# EAGLE schematic AtxPowerDispatcher3 (EAGLE 7.2.0)
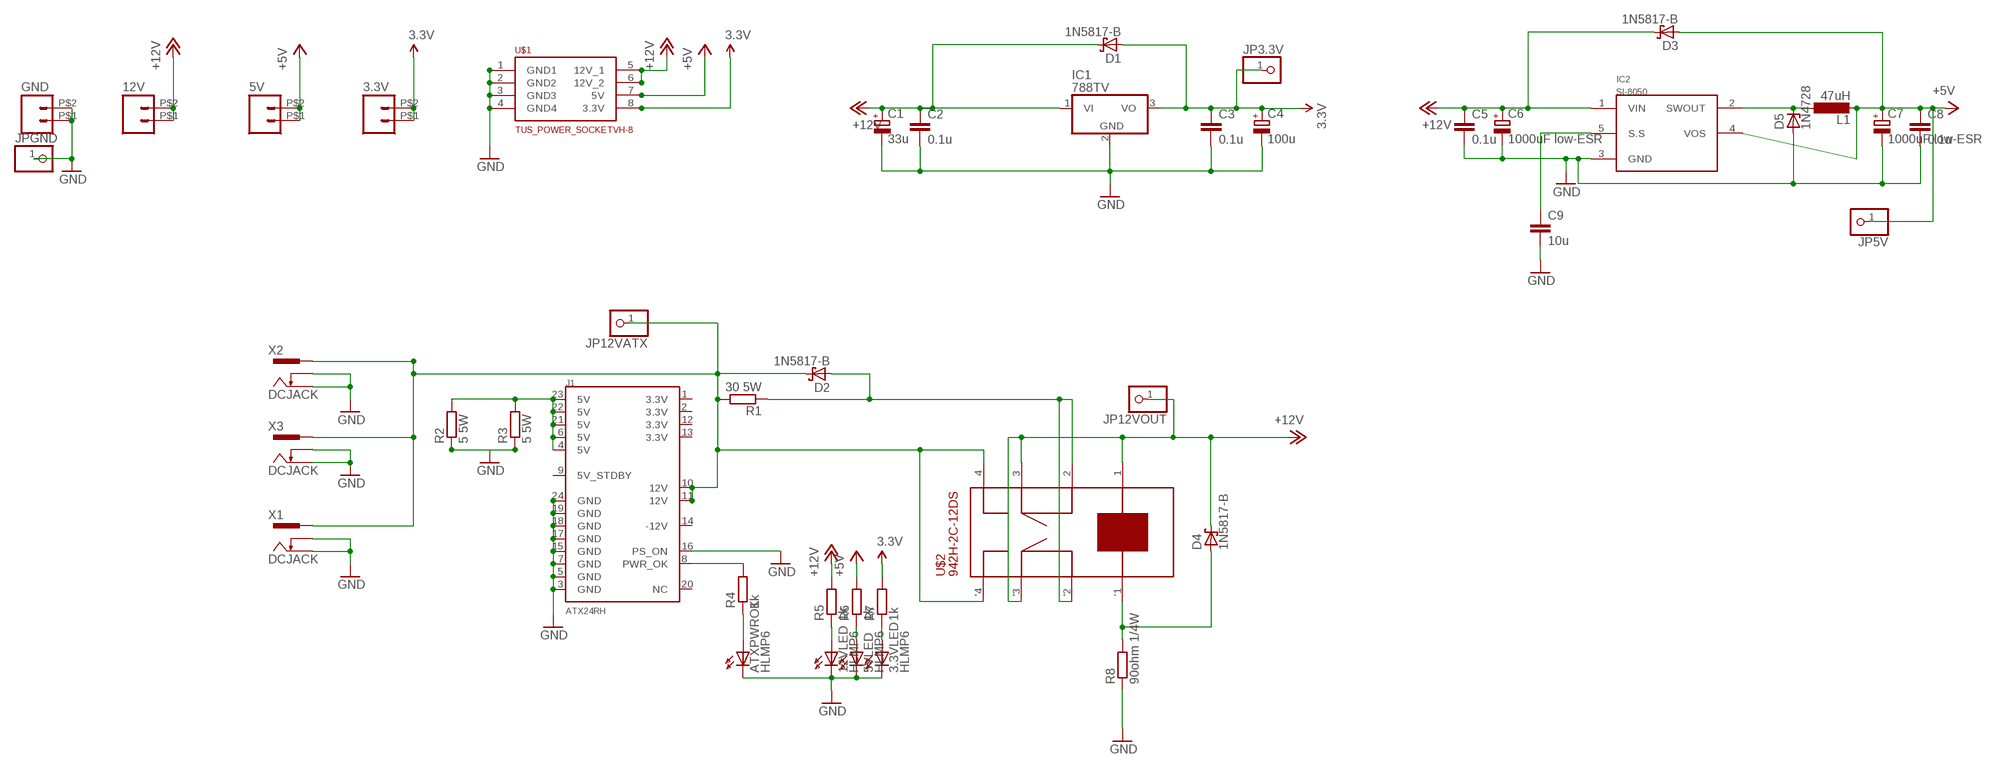
[diagram p0: schematic, sheet 1]

## Parts
3.3V  M02PTH2  [1X02_BIG]
3.3VLED  HLMP6  [HLMP6]
5V  M02PTH2  [1X02_BIG]
5VLED  HLMP6  [HLMP6]
12V  M02PTH2  [1X02_BIG]
12VLED  HLMP6  [HLMP6]
ATXPWROK  HLMP6  [HLMP6]
C1  33u  CPOL-EUE2,5-6E  [E2,5-6E]
C2  0.1u  C-EUC0603  [C0603]
C3  0.1u  C-EUC0603  [C0603]
C4  100u  CPOL-EUE2,5-6E  [E2,5-6E]
C5  0.1u  C-EUC0603  [C0603]
C6  1000uF low-ESR  CPOL-EUE5-10.5  [E5-10,5]
C7  1000uF low-ESR  CPOL-EUE5-10.5  [E5-10,5]
C8  0.1u  C-EUC0603  [C0603]
C9  10u  C-EUC1206  [C1206]
D1  1N5817-B  [DO41-7.6]
D2  1N5817-B  [DO41-7.6]
D3  1N5817-B  [DO41-7.6]
D4  1N5817-B  [DO41-7.6]
D5  1N4728  [DO41Z10]
GND  M02PTH2  [1X02_BIG]
IC1  788TV  [TO220V]
IC2  SI-8050  [TO220-5]
J1  ATX24RH  [ATX24_RIGHT_ANGLE]
JP3.3V  PINHD-1X1  [1X01]
JP5V  PINHD-1X1  [1X01]
JP12VATX  PINHD-1X1  [1X01]
JP12VOUT  PINHD-1X1  [1X01]
JPGND  PINHD-1X1  [1X01]
L1  47uH  L-EU2200-12.7  [2200-12.7]
R1  30 5W  R-EU_0922/22  [0922/22]
R2  5 5W  R-EU_0922/22  [0922/22]
R3  5 5W  R-EU_0922/22  [0922/22]
R4  1k  R-EU_R0603  [R0603]
R5  1k  R-EU_R0603  [R0603]
R6  1k  R-EU_R0603  [R0603]
R7  1k  R-EU_R0603  [R0603]
R8  90ohm 1/4W  R-EU_0207/10  [0207/10]
U$1  TUS_POWER_SOCKETVH-8  [VH_8]
U$2  942H-2C-12DS  [942H]
X1  DCJACK  [2DC-0005D100]
X2  DCJACK  [2DC-0005D100]
X3  DCJACK  [2DC-0005D100]

## Nets
3.3V: 3.3V.P$1 3.3V.P$2 C3.1 C4.+ D1.A IC1.3(VO) JP3.3V.1 R7.2 U$1.8(3.3V)
+5V: 5V.P$1 5V.P$2 C7.+ C8.1 D3.A IC2.4(VOS) JP5V.1 L1.2 R6.2 U$1.7(5V)
+12V: 12V.P$1 12V.P$2 C1.+ C2.1 C5.1 C6.+ D1.C D3.C D4.C IC1.1(VI) IC2.1(VIN) JP12VOUT.1 R5.2 U$1.5(12V_1) U$1.6(12V_2) U$2.1 U$2.3 U$2.'3('2)
GND: 3.3VLED.K 5VLED.K 12VLED.K ATXPWROK.K C1.- C2.2 C3.2 C4.- C5.2 C6.- C7.- C8.2 C9.2 D5.A GND.P$1 GND.P$2 IC1.2(GND) IC2.3(GND) J1.3(GND) J1.5(GND) J1.7(GND) J1.15(GND) J1.16(PS_ON) J1.17(GND) J1.18(GND) J1.19(GND) J1.24(GND) JPGND.1 R2.1 R3.1 R8.1 U$1.1(GND1) U$1.2(GND2) U$1.3(GND3) U$1.4(GND4) X1.2 X1.3 X2.2 X2.3 X3.2 X3.3
N$1: 12VLED.A R5.1
N$2: J1.8(PWR_OK) R4.2
N$3: J1.4(5V) J1.6(5V) J1.21(5V) J1.22(5V) J1.23(5V) R2.2 R3.2
N$4: 5VLED.A R6.1
N$5: 3.3VLED.A R7.1
N$6: ATXPWROK.A R4.1
N$8: D4.A R8.2 U$2.'1('4)
N$9: D5.C IC2.2(SWOUT) L1.1
N$10: D2.A R1.1 U$2.2 U$2.'2('3)
N$11: D2.C J1.10(12V) J1.11(12V) JP12VATX.1 R1.2 U$2.4 U$2.'4('1) X1.1 X2.1 X3.1
N$17: C9.1 IC2.5(S.S)
Unconnected: J1.1(3.3V) J1.2(3.3V) J1.9(5V_STDBY) J1.12(3.3V) J1.13(3.3V) J1.14(-12V) J1.20(NC)

## Library data of the parts
3.3V 5V 12V GND = myparts:M02: Header 2 Standard 2-pin 0.1" header. Use with straight break away headers (SKU : PRT-00116), right angle break away headers (PRT-00553), swiss pins (PRT-00743), machine pins (PRT-00117), and female headers (PRT-00115). Molex polarized connector foot print use with SKU : PRT-08233 with associated crimp pins and housings.
3.3VLED 5VLED 12VLED ATXPWROK = display-hp:HLMP6: LED 2mm horizontal; MF: AGILENT TECHNOLOGIES; MPN: HLMP-6500; OC_FARNELL: 1652490; OC_NEWARK: 40K0088
C1 C4 C6 C7 = rcl:CPOL-EU: POLARIZED CAPACITOR, European symbol
C2 C3 C5 C8 C9 = rcl:C-EU: CAPACITOR, European symbol
D1-D4 = diode:1N581*: 1.0A SCHOTTKY BARRIER RECTIFIER Source: http://www.diodes.com/datasheets/ds23001.pdf
D5 = diode:1N4728: Z DIODE 3.3 V, 1W, 5 percent
IC1 = myparts:78*: Positive VOLTAGE REGULATOR Source: http://cache.national.com/ds/LM/LM78L05.pdf http://www.fairchildsemi.com/ds/LM/LM7805.pdf
IC2 = myparts:SI-80
J1 = SparkFun:ATX24: ATX24 Pin Power Supply Connector This is a good connector for connecting a computer power supply to a PCB. It's massive, but provides many amps of power at 5V and 12V. SKU: PRT-09498
JP3.3V JP5V JP12VATX JP12VOUT JPGND = pinhead:PINHD-1X1: PIN HEADER
L1 = myparts:L-EU: INDUCTOR, European symbol
R1-R3 R8 = resistor:R-EU_: RESISTOR, European symbol
R4-R7 = rcl:R-EU_: RESISTOR, European symbol
U$1 = myparts:TUS_POWER_SOCKET
U$2 = myparts:942H
X1-X3 = kamiki-dcjack:DCJACK: DC JACK 2.1mmφ - 5.5mmφ DCジャック、基板用。